# EAGLE design untitled (EAGLE 6.1)
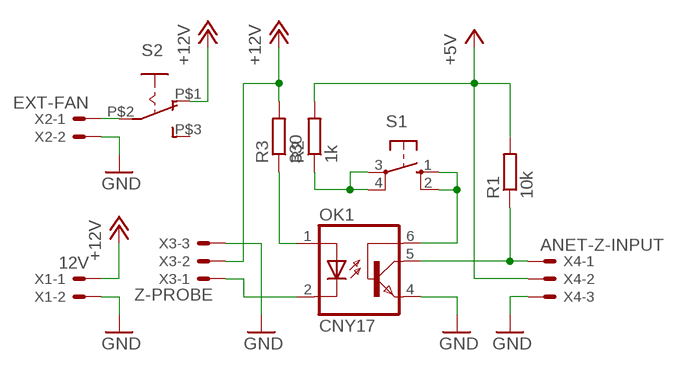
[diagram p0: schematic, sheet 1]

## Parts
OK1  CNY17  [DIL06]
R1  10k  R-EU_M0805  [M0805]
R2  1k  R-EU_M0805  [M0805]
R3  330  R-EU_M0805  [M0805]
S1  10-XX  [B3F-10XX]
S2  EG1218THIN  [THIN]
X1  12V  JST-XH-02-PIN-LONG-PAD  [JST-XH-02-PACKAGE-LONG-PAD]
X2  EXT-FAN  JST-XH-02-PIN-LONG-PAD  [JST-XH-02-PACKAGE-LONG-PAD]
X3  Z-PROBE  JST-XH-03-PIN-LONG-PAD  [JST-XH-03-PACKAGE-LONG-PAD]
X4  ANET-Z-INPUT  JST-XH-03-PIN-LONG-PAD  [JST-XH-03-PACKAGE-LONG-PAD]

## Nets
+5V: R1.2 R2.2 X4.2
+12V: R3.2 S2.P$1(O) X1.1 X3.2
GND: OK1.4(EMI) X1.2 X2.2 X3.3 X4.3
N$1: S2.P$2(P) X2.1
N$2: OK1.5(COL) R1.1 X4.1
N$4: R2.1 S1.3(P) S1.4(P1)
N$5: OK1.6(BAS) S1.1(S) S1.2(S1)
N$6: OK1.1(A) R3.1
N$7: OK1.2(C) X3.1
Unconnected: S2.P$3(S)

## Library data of the parts
OK1 = optocoupler:CNY17: SIEMENS OPTO COUPLER; MPN: CNY17-1; OC_FARNELL: 1045399; OC_NEWARK: 05M4044
R1-R3 = rcl:R-EU_: RESISTOR, European symbol
S1 = switch-omron:10-XX: OMRON SWITCH; MPN: B3F-1000; OC_FARNELL: 176432; OC_NEWARK: 36M3542
S2 = _MY_OWN_LIB:EG1218: SLIDING SWITCH 0.1" spacing through hole, vertical SPDT slide switch http://www.ladyada.net/library/pcb/eaglelibrary.html
X1 X2 = Rembrandt Electronics - JST XH Connectors v1-0:JST-XH-02-PIN: JST XH Connector 2 Pin Wire to board connector. Pitch: 2,54 mm, (0.100") Number of pins: 2 Created by Rembrandt Electronics www.rembrandtelectronics.com
X3 X4 = Rembrandt Electronics - JST XH Connectors v1-0:JST-XH-03-PIN: JST XH Connector 2 Pin Wire to board connector. Pitch: 2,54 mm, (0.100") Number of pins: 3 Created by Rembrandt Electronics www.rembrandtelectronics.com

## Board
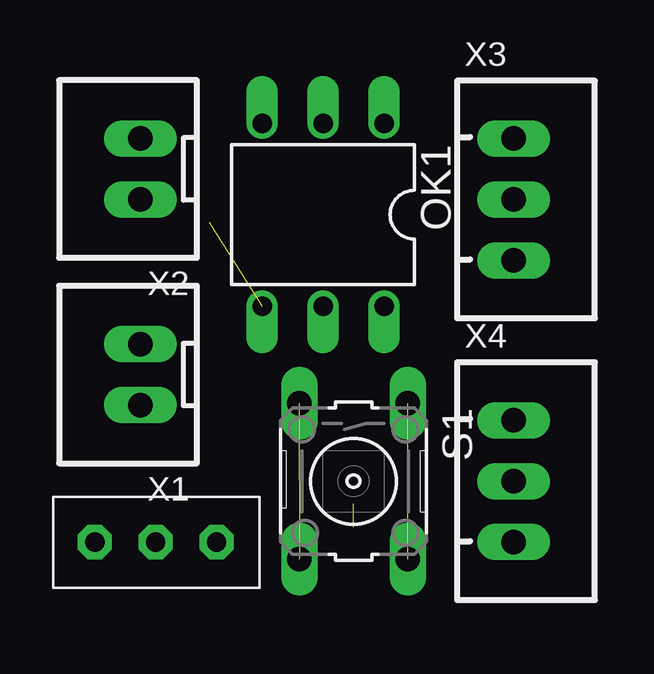
[diagram p1: board, top side]
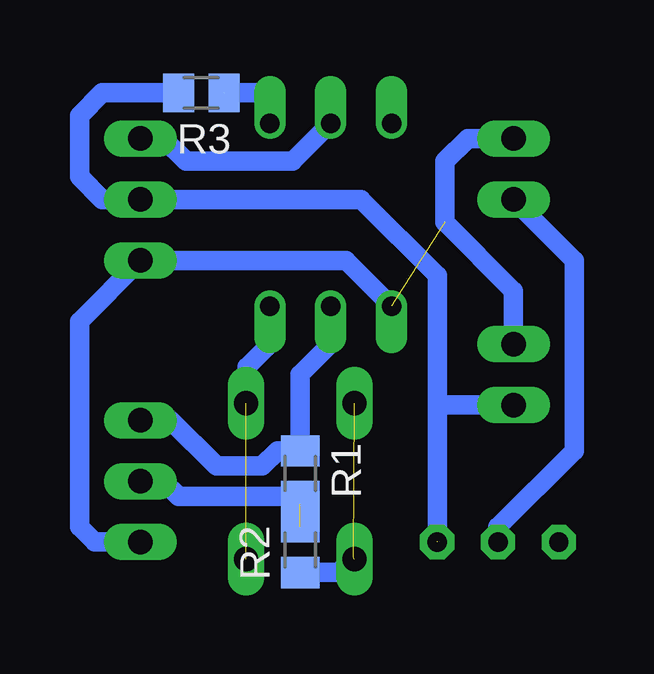
[diagram p2: board, bottom side, seen from below]

No outline drawn. Coordinates in mm, seen from the top.
Copper layers (1*16): Top 0.035mm / dielectric 1.5mm / Bottom 0.035mm
Design rules: minimum track width 10mil, minimum drill 24mil, track to track 12mil, track to pad 12mil, pad to pad 12mil, via to via 12mil, smd to smd 10mil, copper to edge 12mil, drill to drill 12mil, minimum pad ring 10mil, minimum via ring 10mil, stop-mask expansion 4mil, vias tented up to drill 0mil, thermal gap 12mil

### Footprints (pad centres in the part's own frame; a part is rotated, then mirrored left to right if it is on the bottom)
DIL06 = drill 0.813 offset: 1 -2.54,-3.81; 2 0,-3.81; 3 2.54,-3.81; 4 2.54,3.81; 5 0,3.81; 6 -2.54,3.81
M0805 = smd 1.3 x 1.6: 1 -0.95,0; 2 0.95,0
B3F-10XX = drill 1.016 long: 1 -3.251,2.261; 2 3.251,2.261; 3 -3.251,-2.261; 4 3.251,-2.261
THIN = drill 0.8 pad 1.422 octagon: P$1 -2.548,-0.002; P$2 -0.008,-0.002; P$3 2.532,-0.002
JST-XH-02-PACKAGE-LONG-PAD = drill 1.016 long: 1 -1.27,0; 2 1.27,0
JST-XH-03-PACKAGE-LONG-PAD = drill 1.016 long: 1 -2.54,0; 2 0,0; 3 2.54,0

### Placement (x,y rotation side)
OK1  12.7,17.14 180 top
R1  13.97,6.35 270 bottom
R2  10k  [M0805]  13.97,3.17 90 bottom
R3  [M0805]  18.1,22.23 180 bottom
S1  13.97,6.03 270 top
S2  5.71,3.49 180 top
X1  5.08,10.48 90 top
X2  5.08,19.05 90 top
X3  20.64,17.78 270 top
X4  20.64,6.03 270 top

### Tracks (layer width: path | path; a pad name or v marks a point on that pad's centre or on a via)
+5V  (1 unrouted)
  Bottom 0.813: R1.2 | 13.97,5.08 R1.2 | R1.2 19.05,5.4 19.68,6.03 X4.2
+12V  (1 unrouted)
  Bottom 0.813: R3.2 22.23,22.23 23.18,21.27 23.18,18.73 22.23,17.78 X3.2 11.43,17.78 8.26,14.61 8.26,9.21 | 8.26,9.21 S2.P$1 | X1.1 8.26,9.21
GND  (1 unrouted)
  Bottom 0.813: X4.3 22.54,3.49 23.18,4.13 23.18,12.7 X3.3 12.06,15.24 OK1.4 | X1.2 5.08,13.97 7.94,16.83 7.94,19.37 6.99,20.32 X2.2
N$1
  Bottom 0.813: S2.P$2 5.72,4.12 2.54,7.3 2.54,15.24 X2.1
N$2
  Bottom 0.813: OK1.5 12.7,11.75 13.97,10.48 R1.1 14.93,7.3 15.56,6.67 17.46,6.67 19.37,8.57 X4.1
N$4  (2 unrouted)
  Bottom 0.813: R2.1 12.38,2.23 11.75,2.86
N$5  (1 unrouted)
  Bottom 0.813: OK1.6 15.24,11.75 16.19,10.79 16.19,9.32 S1.1
N$6  (1 unrouted)
  Bottom 0.813: OK1.1 15.24,22.23 R3.1
N$7
  Bottom 0.813: X3.1 19.68,20.32 18.73,19.37 14.29,19.37 OK1.2